# EAGLE schematic Motor Driver (EAGLE 7.1.0)
CNAME: Bristol Community College; CREVISION: v1r0; DESIGNER: J. Brian
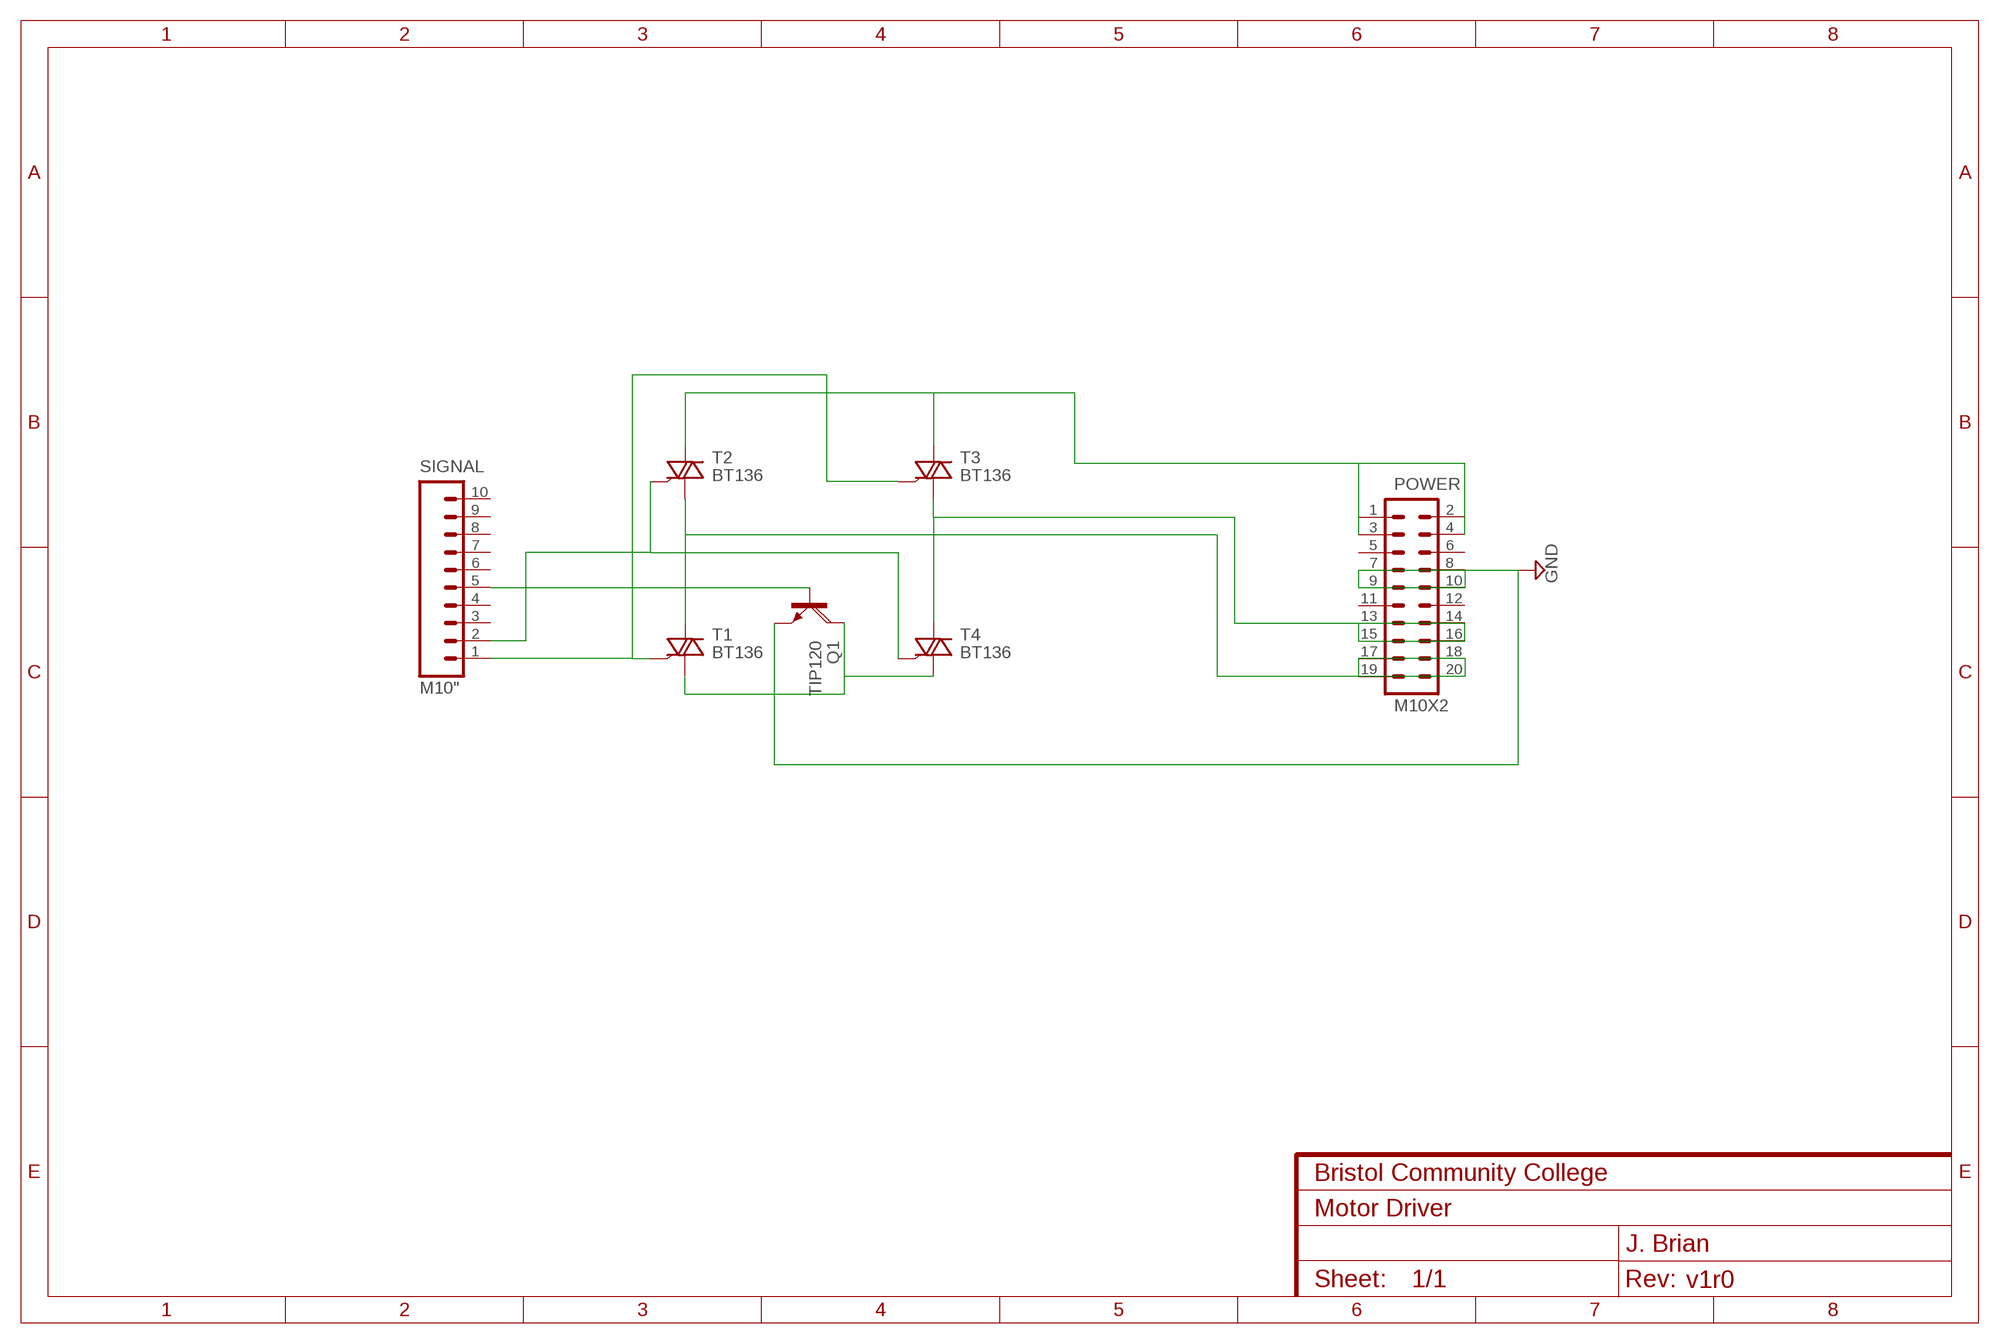
[diagram p0: schematic, sheet 1]

## Parts
POWER  M10X2  [2X10]
Q1  TIP120  [TO220AH]
SIGNAL  M10"  [1X10]
T1  BT136  [TO220AB]
T2  BT136  [TO220AB]
T3  BT136  [TO220AB]
T4  BT136  [TO220AB]

## Nets
GND: POWER.7 POWER.8 POWER.9 POWER.10 Q1.E
N$1: POWER.1 POWER.2 POWER.3 POWER.4 T2.2(A2) T3.2(A2)
N$2: POWER.13 POWER.14 POWER.15 POWER.16 T3.1(A1) T4.2(A2)
N$3: SIGNAL.2 T2.3(G) T4.3(G)
N$4: SIGNAL.1 T1.3(G) T3.3(G)
N$5: Q1.C T1.1(A1) T4.1(A1)
N$6: POWER.17 POWER.18 POWER.19 POWER.20 T1.2(A2) T2.1(A1)
N$11: Q1.B SIGNAL.5
Unconnected: POWER.5 POWER.6 POWER.11 POWER.12 SIGNAL.3 SIGNAL.4 SIGNAL.6 SIGNAL.7 SIGNAL.8 SIGNAL.9 SIGNAL.10

## Library data of the parts
POWER = SparkFun-Connectors:M10X2: This was SPECIALLY designed to be used with our Graphic LCD Backpack. Be sure you want to use this! It is not only staggered on each line of header holes, but IT IS ALSO offset of the center point of the top and bottom lines by 5 mil. This causes the headers to lock into place on the "standard" footprint on the LCD screen. The extra squares on the tdocu layer are there simply to reference other pins (if you were to actually populate a longer header than ten long - this is what we do with the backpacks).
Q1 = transistor-power:TIP120: NPN DARLINGTON TRANSISTOR
SIGNAL = SparkFun-Connectors:M10: Header 10 Standard 10-pin 0.1" header. Use with straight break away headers (SKU : PRT-00116), right angle break away headers (PRT-00553), swiss pins (PRT-00743), machine pins (PRT-00117), and female headers (PRT-00115).
T1-T4 = triac:BT136: Triac BT136 series E sensitive gate Source: http://www.nxp.com/acrobat_download/datasheets/BT136_SERIES_E_2.pdf